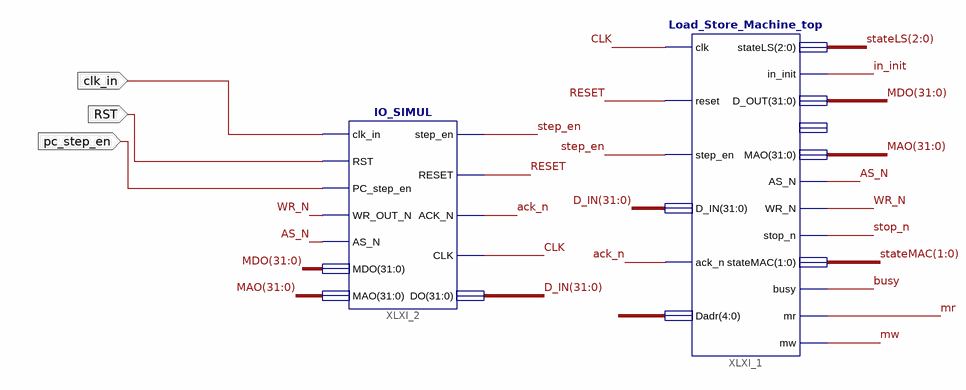
[diagram p0: schematic sheet 1]
// Xilinx ISE schematic LS_ioSimul.sch (spartan6) as structural Verilog: 2 symbols, 3 ports
module LS_ioSimul (
  input  clk_in,
  input  RST,
  input  pc_step_en
);

  wire ack_n, AS_N, busy, CLK, in_init, mr, mw, RESET, step_en, stop_n, WR_N;
  wire [1:0] stateMAC;
  wire [2:0] stateLS;
  wire [4:0] XLXN_31;
  wire [31:0] D_IN, MAO, MDO;

  Load_Store_Machine_top XLXI_1 (
    .clk(CLK), .reset(RESET), .step_en(step_en), .D_IN(D_IN), .ack_n(ack_n), .Dadr(XLXN_31),
    .stateLS(stateLS), .in_init(in_init), .D_OUT(MDO), .MAO(MAO), .AS_N(AS_N), .WR_N(WR_N), .stop_n(stop_n),
    .stateMAC(stateMAC), .busy(busy), .mr(mr), .mw(mw));  // open: D
  IO_SIMUL XLXI_2 (
    .clk_in(clk_in), .RST(RST), .PC_step_en(pc_step_en), .WR_OUT_N(WR_N), .AS_N(AS_N), .MDO(MDO), .MAO(MAO),
    .step_en(step_en), .RESET(RESET), .ACK_N(ack_n), .CLK(CLK), .DO(D_IN));
endmodule
